# EAGLE schematic PushButtons (EAGLE 8.4.1)
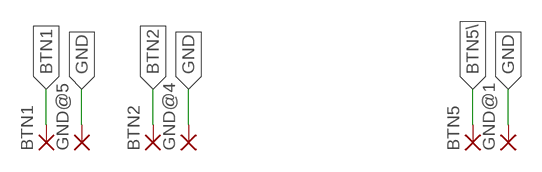
[diagram p0: schematic, sheet 1]

## Parts
BTN1  SMD5  [SMD2,54-5,08]
BTN2  SMD5  [SMD2,54-5,08]
BTN5  SMD5  [SMD2,54-5,08]
GND@1  SMD5  [SMD2,54-5,08]
GND@4  SMD5  [SMD2,54-5,08]
GND@5  SMD5  [SMD2,54-5,08]

## Nets
BTN1: BTN1.1(P)
BTN2: BTN2.1(P)
BTN5\: BTN5.1(P)
GND: GND@1.1(P) GND@4.1(P) GND@5.1(P)

## Library data of the parts
BTN1 BTN2 BTN5 GND@1 GND@4 GND@5 = wirepad:SMD5: SMD PAD